# Altium schematic sheet ECEN403_Team_49_Schematic.SchDoc
size A; SPICEModelCacheSBMTSTMV: <root> / <DocumentId>SBMTSTMV</DocumentId> / </root>
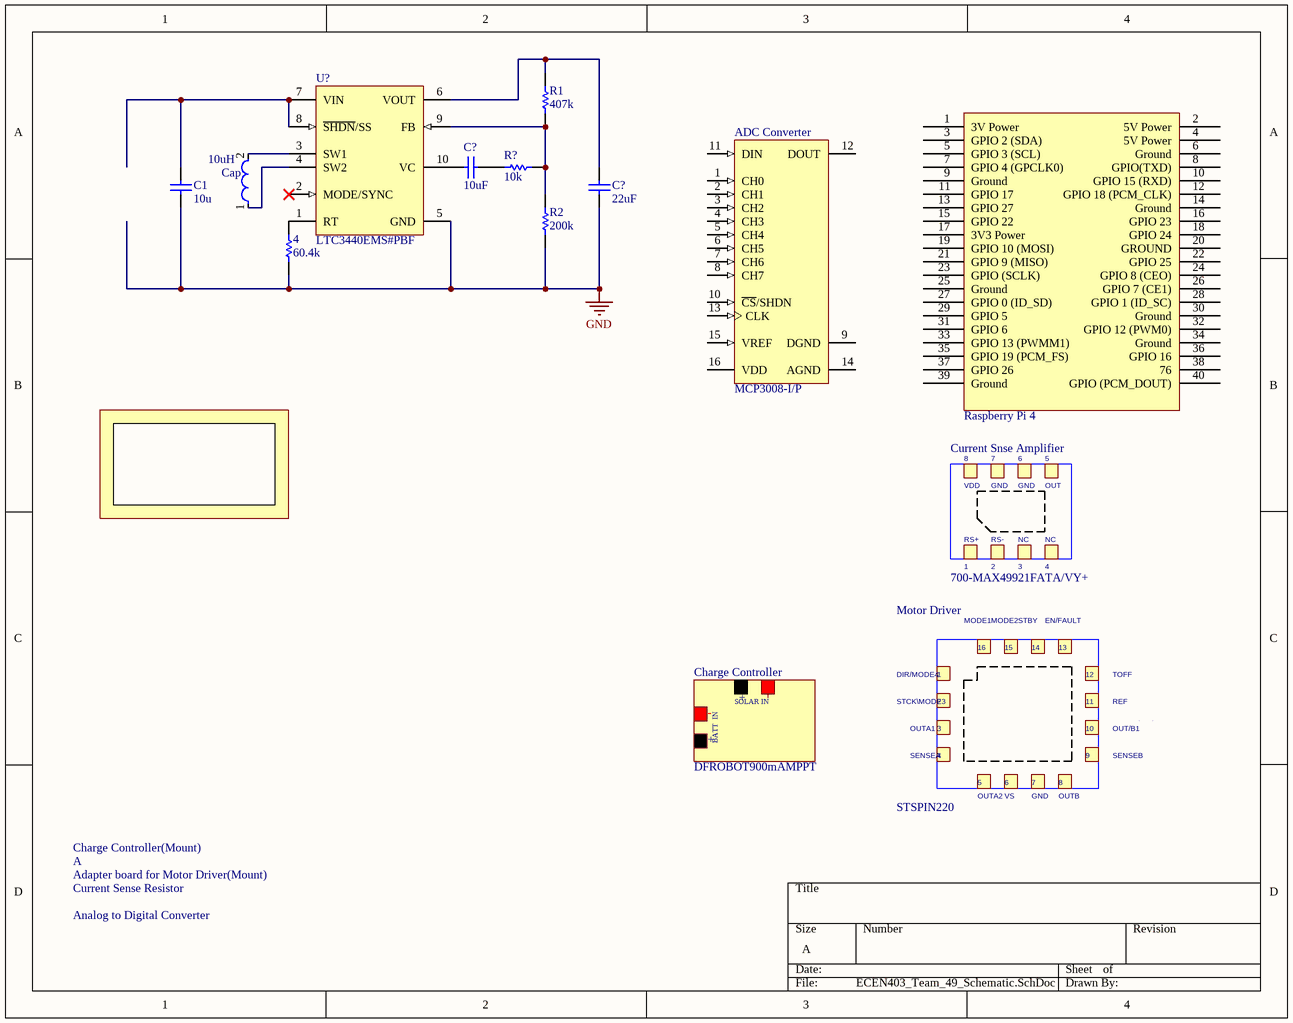
[diagram p0: ECEN403_Team_49_Schematic.SchDoc]

## Parts
(Parts that share a designator on the sheet are numbered #1, #2 ... from top to bottom, then left to right.)
4  60.4k  [RESC1609X50X30NL8T20]
10uH  Cap  [FP-B82422A-MFG]
?  Raspberry Pi 4
ADC_Converter  MCP3008-I/P  [PDIP300-P16]
C1  10u  [CAPC2013X94X50LL20T25]
C?#1  10uF  [CAPC2013X94X50LL20T25]
C?#2  22uF  [CAPC2013X94X50LL20T25]
Charge_Controller  DFROBOT900mAMPPT
Current_Snse_Amplifier  700-MAX49921FATA/VY+
Motor_Driver  STSPIN220
R1  407k  [RESC1609X50X30NL8T20]
R2  200k  [RESC1609X50X30NL8T20]
R?  10k  [RESC1609X50X30NL8T20]
U?  LTC3440EMS#PBF  [LT-MS-10_M]

## Nets
GND: 4.2 C1.1 C?#2.1 R2.1 U?.5(GND)
Net4_1: 4.1 U?.1(RT)
Net10uH_1: 10uH.1 U?.4(SW2)
Net10uH_2: 10uH.2 U?.3(SW1)
NetC1_2: C1.2 U?.7(VIN) U?.8(~{SHDN}/SS)
NetC?#1_1: C?#1.1 U?.10(VC)
NetC?#1_2: C?#1.2 R?.1
NetC?#2_2: C?#2.2 R1.2 U?.6(VOUT)
NetR1_1: R1.1 R2.2 R?.2 U?.9(FB)

Not connected (* = marked no-connect by the designer): ? 1(3V_Power) 2(5V_Power) 3(GPIO_2_(SDA)) 4(5V_Power) 5(GPIO_3_(SCL)) 6(Ground) 7(GPIO_4_(GPCLK0)) 8(GPIO(TXD)) 9(Ground) 10(GPIO_15_(RXD)) 11(GPIO_17) 12(GPIO_18_(PCM_CLK)) 13(GPIO_27) 14(Ground) 15(GPIO_22) 16(GPIO_23) 17(3V3_Power) 18(GPIO_24) 19(GPIO_10_(MOSI)) 20(GROUND) 21(GPIO_9_(MISO)) 22(GPIO_25) 23(GPIO_(SCLK)) 24(GPIO_8_(CEO)) 25(Ground) 26(GPIO_7_(CE1)) 27(GPIO_0_(ID_SD)) 28(GPIO_1_(ID_SC)) 29(GPIO_5) 30(Ground) 31(GPIO_6) 32(GPIO_12_(PWM0)) 33(GPIO_13_(PWMM1)) 34(Ground) 35(GPIO_19_(PCM_FS)) 36(GPIO_16) 37(GPIO_26) 38(76) 39(Ground) 40(GPIO_(PCM_DOUT)); ADC_Converter 1(CH0) 2(CH1) 3(CH2) 4(CH3) 5(CH4) 6(CH5) 7(CH6) 8(CH7) 9(DGND) 10(~{CS}/SHDN) 11(DIN) 12(DOUT) 13(CLK) 14(AGND) 15(VREF) 16(VDD); U? 2(MODE/SYNC)*

## Notes on the sheet
- Adapter board for Motor Driver(Mount)
- Charge Controller(Mount)
- A
- Current Sense Resistor
- Analog to Digital Converter
- (in symbol 700-MAX49921FATA/VY+) 8; 7; 6; 5; VDD; GND; OUT; RS+; RS-; NC; 1; 2; 3; 4
- (in symbol DFROBOT900mAMPPT) +; -; SOLAR IN; BATT  IN
- (in symbol STSPIN220) MODE1; MODE2; STBY; EN/FAULT; 16; 15; 14; 13; DIR/MODE4; 1; 12; TOFF; STCK\MODE3; 2; 11; REF; OUTA1; 3; 10; OUT/B1; SENSEA; 4; 9; SENSEB; 5; 6; 7; 8; OUTA2; VS; GND; OUTB

## Library data of the parts
4 R1 R2 R? = CMP-2000-03816-5: Chip Resistor, 0 Ohm, Jumper, 100 mW, -55 to 155 degC, 0603 (1608 Metric), RoHS, Tape and Reel; Manufacturer: Vishay Semiconductor; Voltage Rating: 75 V; Package Quantity: 5000; DatasheetVersion: 06/2012; Min Operating Temperature: -55 degC; ComponentLink1URL: http://www.vishay.com/; Mounting Technology: Surface Mount; Height: 0.45 mm; ComponentLink1Description: Manufacturer URL; REACH SVHC: Unknown; PackageReference: 0603; Packaging: Tape and Reel; Max Operating Temperature: 155 degC; Mount: Surface Mount; ComponentLink2Description: Datasheet; PackageDescription: 2-Pin Surface Mount Device, Body 1.575 x 0.85 mm; Length: 1.55 mm; ComponentLink2URL: http://www.vishay.com/docs/20035/dcrcwe3.pdf; Pins: 2; RoHSCompliant: true
10uH = CMP-2000-05912-2: FIXED IND 10UH 180MA 1.6 OHM SMD; Tolerance: 10%; Core Material: Ferrite; Q Factor: 27; Self Resonant Frequency: 25MHz; Shielding: Unshielded; Test Frequency: 1MHz; Series Resistance: 1.6R; Radiation Hardening: No; REACH SVHC: No SVHC; Width: 0.098inch; RoHS Compliant: Yes; Case/Package: 1210; DC Current: 180mA; Package Quantity: 2000; Height - Seated (Max): 0.083inch; Rated Current-Max: 180mA; Series: SIMID; Mount: Surface Mount; Depth: 2.8mm; Resistor Type: Wirewound; Max DC Current: 180mA; Termination: SMD/SMT; Contact Plating: Tin; Height: 2.1mm; Inductance: 10uH; Case Code (Metric): 3225; Lead Free: Lead Free; Weight: 0.001764oz; Max Operating Temperature: 125°C; Length: 3.5mm; Packaging: Tape and Reel; Case Code (Imperial): 1210; Inductance Tolerance: 10%; Ratings: AEC-Q200; Number of Pins: 2; Current Rating: 180mA; Military Standard: Not; DC Resistance (DCR): 1.6R
? = Raspberry Pi
ADC_Converter = CMP-0188-00184-2: 2.7V 4-Channel/8-Channel 10-Bit A/D Converters with SPI Serial Interface, 16-Pin PDIP, Industrial Temperature; ComponentLink1URL: http://www.microchip.com/; ComponentLink2URL: http://ww1.microchip.com/downloads/en/DeviceDoc/21295d.pdf; PackageVersion: revBB, Aug-2009; ComponentLink3URL: http://www.microchip.com/stellent/groups/techpub_sg/documents/packagingspec/en012702.pdf; DatasheetVersion: revD, Dec-2008; PackageDescription: 16-Lead Plastic Dual In-Line (P) - 300 mil Body [PDIP]; ComponentLink3Description: Package Specification; Code_JEDEC: MS-001-BB; ComponentLink1Description: Manufacturer URL; RevisionNote: URLs added.; PackageReference: PDIP300-P16; ComponentLink2Description: Datasheet
C1 C?#1 C?#2 = CMP-2007-04163-1: Manufacturer: AVX Interconnect / Elco; Part Number: 08051C103JAT2A
Charge_Controller = DFROBOT900mAMPPT: Charge Controller
Current_Snse_Amplifier = 700-MAX49921FATA/VY+: Current Sense Amplifier
Motor_Driver = STSPIN220: Motor Driver
U? = CMP-0492-01290-1: Micropower Synchronous Buck-Boost DC/DC Converter, 10-pin SOP (MS-10), -40 to 85 degC, Pb-Free; Manufacturer: Linear Technology; Frequency Sync Range: 300kHz - 2MHz; Number of Outputs: 1; DatasheetVersion: Rev. B; PackageVersion: Rev. E, 06/2010; ComponentLink2Description: Datasheet; ComponentLink1URL: http://www.linear.com/; ComponentLink3URL: http://cds.linear.com/docs/en/packaging/05081661_F_MS.pdf; PackageDescription: 10-Pin Plastic MSOP, Body 3 x 3 mm, Pitch 0.5 mm; ComponentLink1Description: Manufacturer URL; Mounting Technology: Surface Mount; RoHS: TRUE; ComponentLink3Description: Package Specification; ComponentLink2URL: http://cds.linear.com/docs/en/datasheet/3440fb.pdf; PartNumber: LTC3440EMS#PBF; PackageReference: MS-10